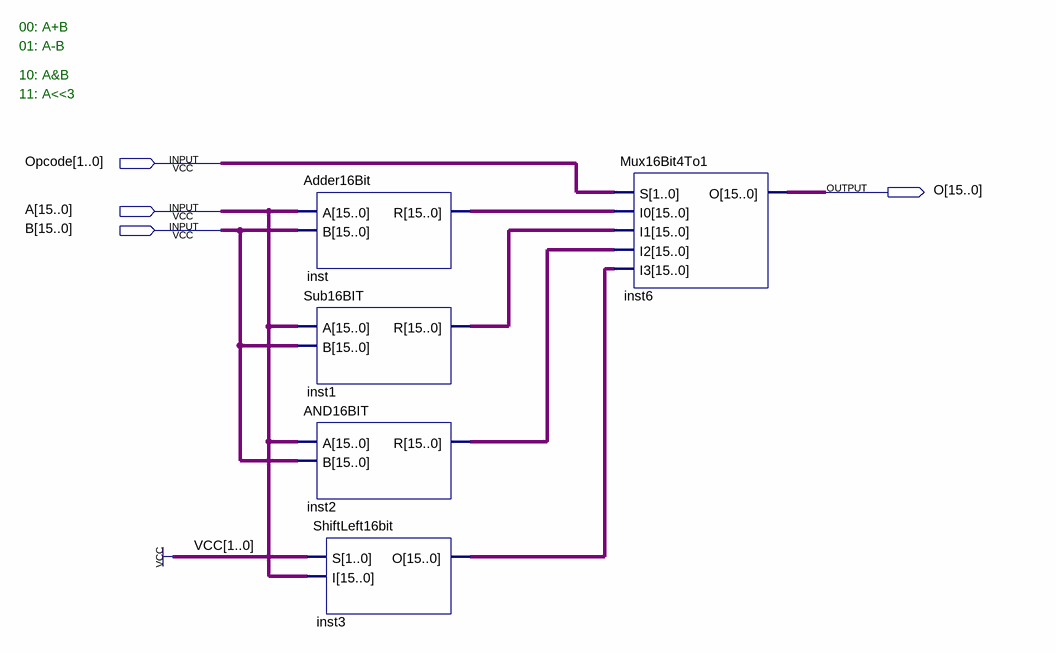
[diagram p0: schematic sheet]
// Quartus schematic ALULap04.bdf as structural Verilog: 5 symbols, 4 pins
module ALULap04 (
  input  [1:0] Opcode,
  input  [15:0] A,
  input  [15:0] B,
  output [15:0] O
);

  wire [15:0] inst1_r, inst2_r, inst3_o, inst_r;

  Adder16Bit inst (.A(A), .B(B), .R(inst_r));
  Sub16BIT inst1 (.A(A), .B(B), .R(inst1_r));
  AND16BIT inst2 (.A(A), .B(B), .R(inst2_r));
  ShiftLeft16bit inst3 (.S(2'b11), .I(A), .O(inst3_o));
  Mux16Bit4To1 inst6 (.S(Opcode), .I0(inst_r), .I1(inst1_r), .I2(inst2_r), .I3(inst3_o), .O(O));

  // Notes on the sheet:
  //   00: A+B
  //   01: A-B
  //   10: A&B
  //   11: A<<3
endmodule
